# Altium schematic sheet IMX7S_CPU_INTERFACES_2.SchDoc
size A2
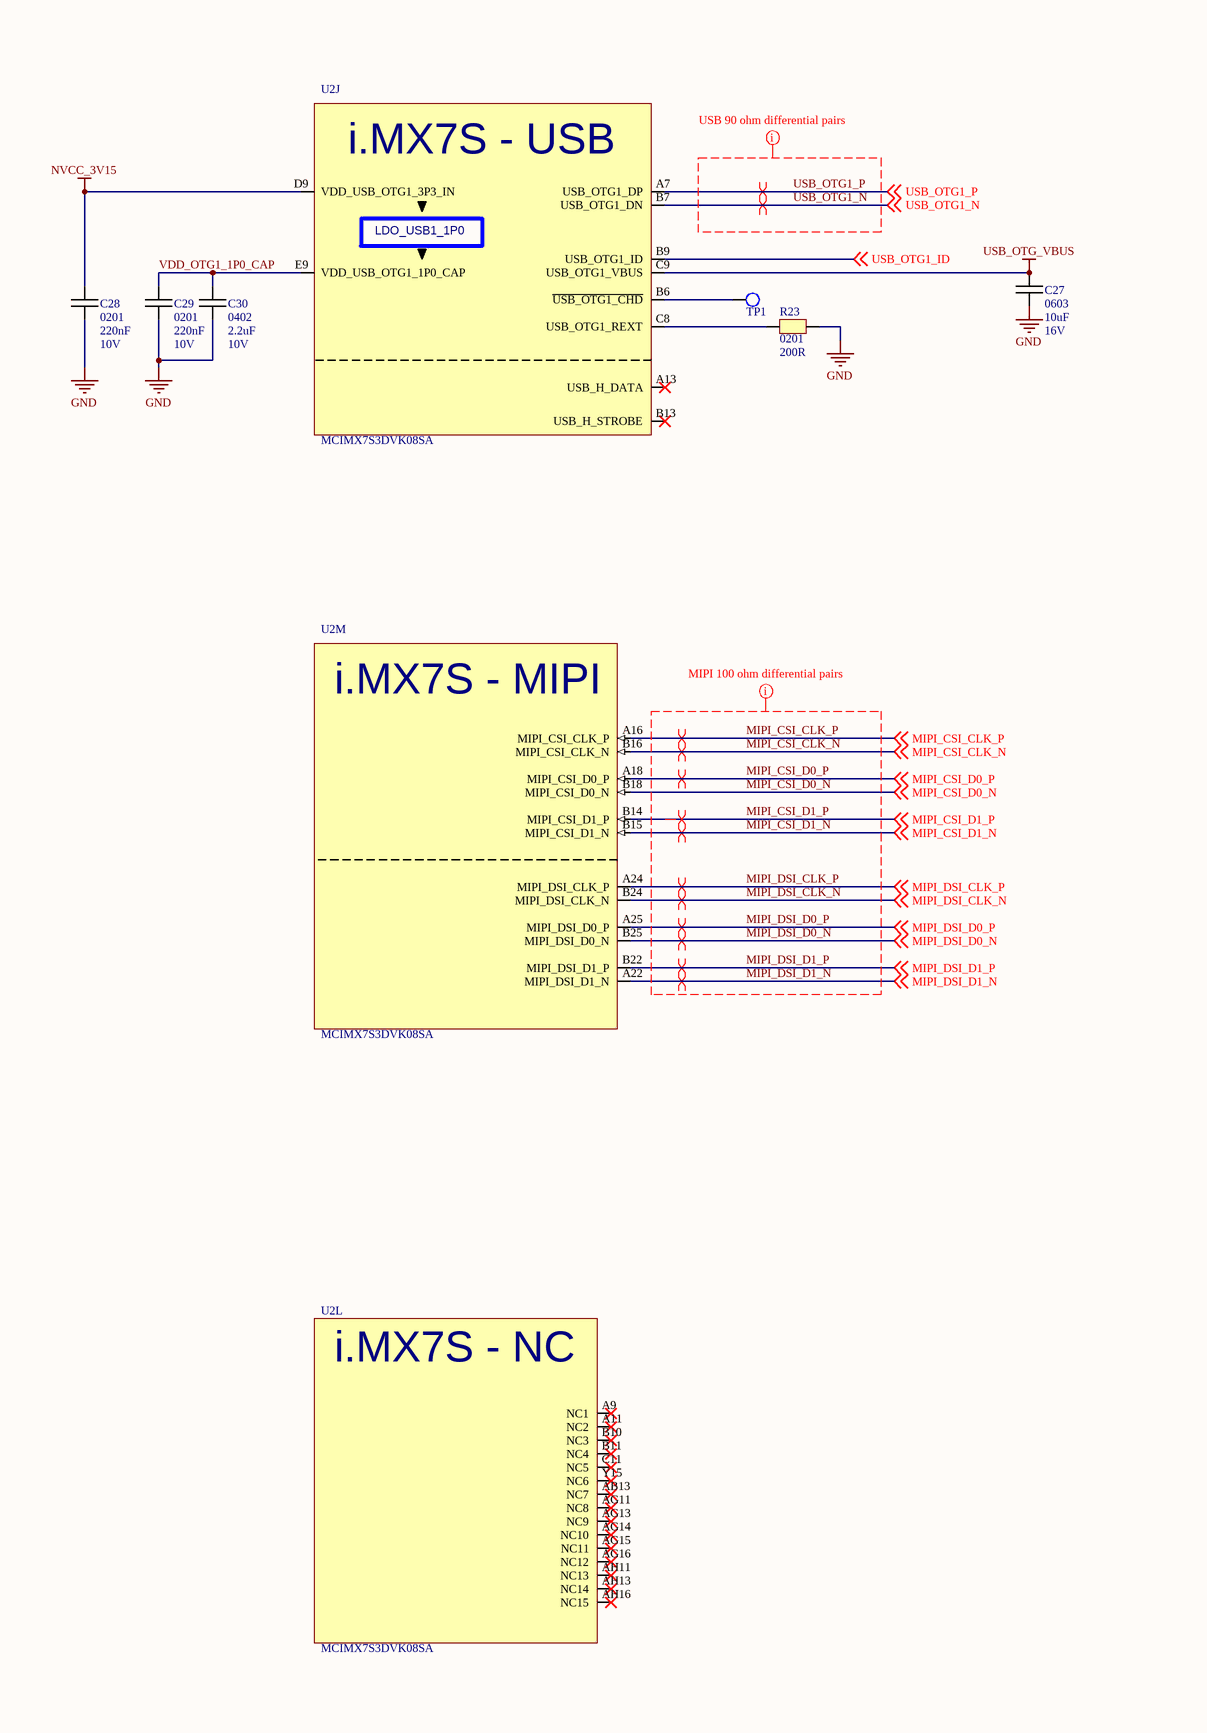
[diagram p0: IMX7S_CPU_INTERFACES_2.SchDoc, left]
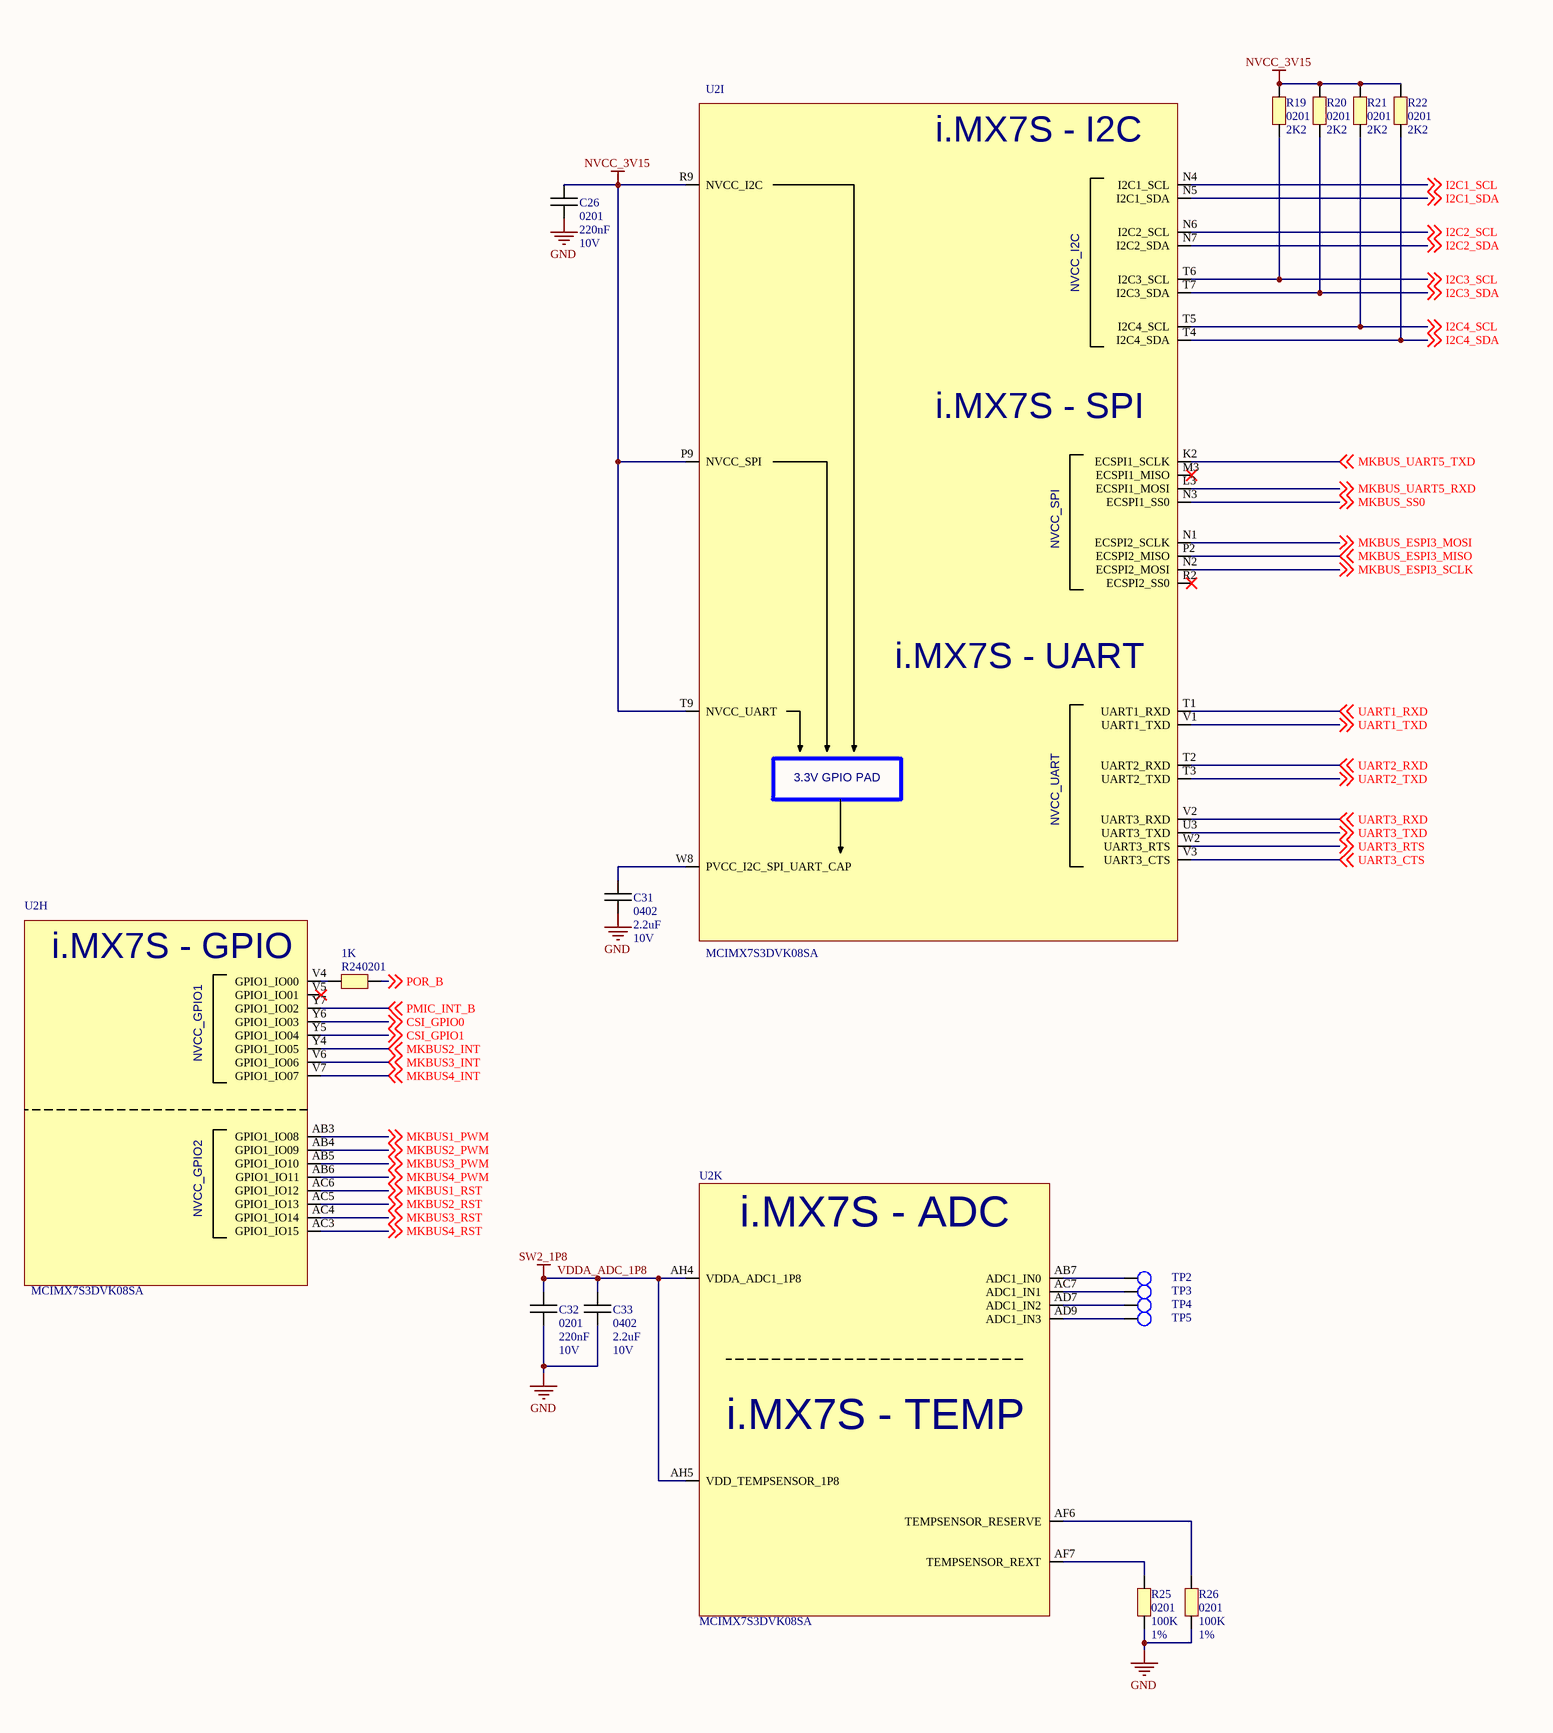
[diagram p1: IMX7S_CPU_INTERFACES_2.SchDoc, right]

## Parts
C26  value 220nF  PACKAGE: 0201  VOLTAGE: 10V  [C0201]  (hidden comment: C0201)
C27  value 10uF  PACKAGE: 0603  VOLTAGE: 16V  [C0603]  (hidden comment: C0603)
C28  value 220nF  PACKAGE: 0201  VOLTAGE: 10V  [C0201]  (hidden comment: C0201)
C29  value 220nF  PACKAGE: 0201  VOLTAGE: 10V  [C0201]  (hidden comment: C0201)
C30  value 2.2uF  PACKAGE: 0402  VOLTAGE: 10V  [C0402]  (hidden comment: C0402)
C31  value 2.2uF  PACKAGE: 0402  VOLTAGE: 10V  [C0402]  (hidden comment: C0402)
C32  value 220nF  PACKAGE: 0201  VOLTAGE: 10V  [C0201]  (hidden comment: C0201)
C33  value 2.2uF  PACKAGE: 0402  VOLTAGE: 10V  [C0402]  (hidden comment: C0402)
R19  value 2K2  PACKAGE: 0201  [R0201]  (hidden comment: R0201)
R20  value 2K2  PACKAGE: 0201  [R0201]  (hidden comment: R0201)
R21  value 2K2  PACKAGE: 0201  [R0201]  (hidden comment: R0201)
R22  value 2K2  PACKAGE: 0201  [R0201]  (hidden comment: R0201)
R23  value 200R  PACKAGE: 0201  [R0201]  (hidden comment: R0201)
R24  value 1K  PACKAGE: 0201  [R0201]  (hidden comment: R0201)
R25  value 100K  PACKAGE: 0201  VOLTAGE: 1%  [R0201]  (hidden comment: R0201)
R26  value 100K  PACKAGE: 0201  VOLTAGE: 1%  [R0201]  (hidden comment: R0201)
TP1  TestPoint  [TESTPOINT]  (value not drawn)
TP2  TestPoint  [TESTPOINT]  (value not drawn)
TP3  TestPoint  [TESTPOINT]  (value not drawn)
TP4  TestPoint  [TESTPOINT]  (value not drawn)
TP5  TestPoint  [TESTPOINT]  (value not drawn)
U2  MCIMX7S3DVK08SA  [BGA 488 PIN]  (parts H,I,J,K,L,M of 13)

## Nets
GND: C26.1 C27.1 C28.1 C29.1 C30.1 C31.1 C32.1 C33.1 R23.2 R25.1 R26.1
NVCC_3V15: C26.2 C28.2 R19.2 R20.2 R21.2 R22.2 U2.D9(VDD_USB_OTG1_3P3_IN) U2.P9(NVCC_SPI) U2.R9(NVCC_I2C) U2.T9(NVCC_UART)
USB_OTG_VBUS: C27.2 U2.C9(USB_OTG1_VBUS)
VDDA_ADC_1P8: C32.2 C33.2 U2.AH4(VDDA_ADC1_1P8) U2.AH5(VDD_TEMPSENSOR_1P8)  [also labelled SW2_1P8]
CSI_GPIO0: U2.Y6(GPIO1_IO03) ; off-sheet CSI_GPIO0
CSI_GPIO1: U2.Y5(GPIO1_IO04) ; off-sheet CSI_GPIO1
I2C1_SCL: U2.N4(I2C1_SCL) ; off-sheet I2C1_SCL
I2C1_SDA: U2.N5(I2C1_SDA) ; off-sheet I2C1_SDA
I2C2_SCL: U2.N6(I2C2_SCL) ; off-sheet I2C2_SCL
I2C2_SDA: U2.N7(I2C2_SDA) ; off-sheet I2C2_SDA
I2C3_SCL: R19.1 U2.T6(I2C3_SCL) ; off-sheet I2C3_SCL
I2C3_SDA: R20.1 U2.T7(I2C3_SDA) ; off-sheet I2C3_SDA
I2C4_SCL: R21.1 U2.T5(I2C4_SCL) ; off-sheet I2C4_SCL
I2C4_SDA: R22.1 U2.T4(I2C4_SDA) ; off-sheet I2C4_SDA
MIPI_CSI_CLK_N: U2.B16(MIPI_CSI_CLK_N) ; off-sheet MIPI_CSI_CLK_N
MIPI_CSI_CLK_P: U2.A16(MIPI_CSI_CLK_P) ; off-sheet MIPI_CSI_CLK_P
MIPI_CSI_D0_N: U2.B18(MIPI_CSI_D0_N) ; off-sheet MIPI_CSI_D0_N
MIPI_CSI_D0_P: U2.A18(MIPI_CSI_D0_P) ; off-sheet MIPI_CSI_D0_P
MIPI_CSI_D1_N: U2.B15(MIPI_CSI_D1_N) ; off-sheet MIPI_CSI_D1_N
MIPI_CSI_D1_P: U2.B14(MIPI_CSI_D1_P) ; off-sheet MIPI_CSI_D1_P
MIPI_DSI_CLK_N: U2.B24(MIPI_DSI_CLK_N) ; off-sheet MIPI_DSI_CLK_N
MIPI_DSI_CLK_P: U2.A24(MIPI_DSI_CLK_P) ; off-sheet MIPI_DSI_CLK_P
MIPI_DSI_D0_N: U2.B25(MIPI_DSI_D0_N) ; off-sheet MIPI_DSI_D0_N
MIPI_DSI_D0_P: U2.A25(MIPI_DSI_D0_P) ; off-sheet MIPI_DSI_D0_P
MIPI_DSI_D1_N: U2.A22(MIPI_DSI_D1_N) ; off-sheet MIPI_DSI_D1_N
MIPI_DSI_D1_P: U2.B22(MIPI_DSI_D1_P) ; off-sheet MIPI_DSI_D1_P
MKBUS1_PWM: U2.AB3(GPIO1_IO08) ; off-sheet MKBUS1_PWM
MKBUS1_RST: U2.AC6(GPIO1_IO12) ; off-sheet MKBUS1_RST
MKBUS2_INT: U2.Y4(GPIO1_IO05) ; off-sheet MKBUS2_INT
MKBUS2_PWM: U2.AB4(GPIO1_IO09) ; off-sheet MKBUS2_PWM
MKBUS2_RST: U2.AC5(GPIO1_IO13) ; off-sheet MKBUS2_RST
MKBUS3_INT: U2.V6(GPIO1_IO06) ; off-sheet MKBUS3_INT
MKBUS3_PWM: U2.AB5(GPIO1_IO10) ; off-sheet MKBUS3_PWM
MKBUS3_RST: U2.AC4(GPIO1_IO14) ; off-sheet MKBUS3_RST
MKBUS4_INT: U2.V7(GPIO1_IO07) ; off-sheet MKBUS4_INT
MKBUS4_PWM: U2.AB6(GPIO1_IO11) ; off-sheet MKBUS4_PWM
MKBUS4_RST: U2.AC3(GPIO1_IO15) ; off-sheet MKBUS4_RST
MKBUS_ESPI3_MISO: U2.P2(ECSPI2_MISO) ; off-sheet MKBUS_ESPI3_MISO
MKBUS_ESPI3_MOSI: U2.N1(ECSPI2_SCLK) ; off-sheet MKBUS_ESPI3_MOSI
MKBUS_ESPI3_SCLK: U2.N2(ECSPI2_MOSI) ; off-sheet MKBUS_ESPI3_SCLK
MKBUS_SS0: U2.N3(ECSPI1_SS0) ; off-sheet MKBUS_SS0
MKBUS_UART5_RXD: U2.L3(ECSPI1_MOSI) ; off-sheet MKBUS_UART5_RXD
MKBUS_UART5_TXD: U2.K2(ECSPI1_SCLK) ; off-sheet MKBUS_UART5_TXD
PMIC_INT_B: U2.Y7(GPIO1_IO02) ; off-sheet PMIC_INT_B
POR_B: R24.1 ; off-sheet POR_B
UART1_RXD: U2.T1(UART1_RXD) ; off-sheet UART1_RXD
UART1_TXD: U2.V1(UART1_TXD) ; off-sheet UART1_TXD
UART2_RXD: U2.T2(UART2_RXD) ; off-sheet UART2_RXD
UART2_TXD: U2.T3(UART2_TXD) ; off-sheet UART2_TXD
UART3_CTS: U2.V3(UART3_CTS) ; off-sheet UART3_CTS
UART3_RTS: U2.W2(UART3_RTS) ; off-sheet UART3_RTS
UART3_RXD: U2.V2(UART3_RXD) ; off-sheet UART3_RXD
UART3_TXD: U2.U3(UART3_TXD) ; off-sheet UART3_TXD
USB_OTG1_ID: U2.B9(USB_OTG1_ID) ; off-sheet USB_OTG1_ID
USB_OTG1_N: U2.B7(USB_OTG1_DN) ; off-sheet USB_OTG1_N
USB_OTG1_P: U2.A7(USB_OTG1_DP) ; off-sheet USB_OTG1_P
VDD_OTG1_1P0_CAP: C29.2 C30.2 U2.E9(VDD_USB_OTG1_1P0_CAP)
NetC31_2: C31.2 U2.W8(PVCC_I2C_SPI_UART_CAP)
NetR23_1: R23.1 U2.C8(USB_OTG1_REXT)
NetR24_2: R24.2 U2.V4(GPIO1_IO00)
NetR25_2: R25.2 U2.AF7(TEMPSENSOR_REXT)
NetR26_2: R26.2 U2.AF6(TEMPSENSOR_RESERVE)
NetTP1_1: TP1.1 U2.B6(~{USB_OTG1_CHD})
NetTP2_1: TP2.1 U2.AB7(ADC1_IN0)
NetTP3_1: TP3.1 U2.AC7(ADC1_IN1)
NetTP4_1: TP4.1 U2.AD7(ADC1_IN2)
NetTP5_1: TP5.1 U2.AD9(ADC1_IN3)

Not connected (* = marked no-connect by the designer): U2 A9(NC1)* A11(NC2)* A13(USB_H_DATA)* AB13(NC7)* AG11(NC8)* AG13(NC9)* AG14(NC10)* AG15(NC11)* AG16(NC12)* AH11(NC13)* AH13(NC14)* AH16(NC15)* B10(NC3)* B11(NC4)* B13(USB_H_STROBE)* C11(NC5)* M3(ECSPI1_MISO)* R2(ECSPI2_SS0)* V5(GPIO1_IO01)* Y15(NC6)*

## Layout directives
differential pair: MIPI_CSI_CLK_N, MIPI_CSI_CLK_P, MIPI_CSI_D0_P, MIPI_CSI_D1_N, MIPI_CSI_D1_P, MIPI_DSI_CLK_N, MIPI_DSI_CLK_P, MIPI_DSI_D0_N, MIPI_DSI_D0_P, MIPI_DSI_D1_N, MIPI_DSI_D1_P, USB_OTG1_N, USB_OTG1_P
mark named USB 90 ohm differential pairs: USB_OTG1_N, USB_OTG1_P
mark named MIPI 100 ohm differential pairs: MIPI_CSI_CLK_N, MIPI_CSI_CLK_P, MIPI_CSI_D0_N, MIPI_CSI_D0_P, MIPI_CSI_D1_N, MIPI_CSI_D1_P, MIPI_DSI_CLK_N, MIPI_DSI_CLK_P, MIPI_DSI_D0_N, MIPI_DSI_D0_P, MIPI_DSI_D1_N, MIPI_DSI_D1_P

## Notes on the sheet
- Title
- Size:
- Date:
- File:
- A2
- Number:
- Time:
- Revision:
- Sheet
- of
- (in symbol MCIMX7S3DVK08SD, part H) i.MX7S - GPIO
- (in symbol MCIMX7S3DVK08SD, part I) i.MX7S - I2C; i.MX7S - SPI; i.MX7S - UART; 3.3V GPIO PAD
- (in symbol MCIMX7S3DVK08SD, part J) i.MX7S - USB; LDO_USB1_1P0
- (in symbol MCIMX7S3DVK08SD, part K) i.MX7S - ADC; i.MX7S - TEMP
- (in symbol MCIMX7S3DVK08SD, part L) i.MX7S - NC
- (in symbol MCIMX7S3DVK08SD, part M) i.MX7S - MIPI

## Library data of the parts
C26 C28 C29 C32 = C0201: Manufacturer 1: Murata; Manufacturer Part Number 1: GRM033R61A224KE90D; Tolerance: 10%; Dielectric: X5R; Supplier 1: Farnell; Supplier Part Number 1: 2990687; Stock 1: 4290; Pricing 1: 10=0,04270, 100=0,02370, 500=0,01800, 2500=0,01350, 7500=0,00950, 15000=0,00760, 75000=0,00630 (EUR); RoHS: Yes; Mount: Surface Mount; Case/Package: 0201; Case Code (Metric): 0603; Case Code (Imperial): 0201; Min Operating Temperature: -55°C; Max Operating Temperature: 85°C; Capacitance: 220nF; Voltage Rating (DC): 10V; Packaging: Tape and Reel; Voltage Rating: 10V; Length: 0.024inch; Width: 0.012inch; Thickness: 0.013inch; ComponentLink1URL: http://www.mouser.com/ds/2/281/c02e-2905.pdf?src-supplier=Mouser; ComponentLink1Description: http://www.mouser.com/ds/2/281/c02e-2905.pdf?src-supplier=Mouser; ComponentLink2URL: http://search.murata.co.jp/Ceramy/image/img/A01X/G101/ENG/GRM033R61A224KE90-01.pdf?src-supplier=Digi-Key; ComponentLink2Description: http://search.murata.co.jp/Ceramy/image/img/A01X/G101/ENG/GRM033R61A224KE90-01.pdf?src-supplier=Digi-Key
C27 = C0603: Manufacturer 1: Murata; Manufacturer Part Number 1: GRM188R61A106KE69D; Description: Cap Ceramic 10uF 10V X5R 10% SMD 0603 85C Paper T/R; Tolerance: 10%; Dielectric: X5R; Voltage Rating: 10V; Supplier 1: Farnell; Supplier Part Number 1: 2666494; Stock 1: 472000; Pricing 1: 4000=0,02960, 20000=0,02600 (EUR); RoHS: Yes; Mount: Surface Mount; Case/Package: 0603; Case Code (Metric): 1608; Case Code (Imperial): 0603; Min Operating Temperature: -55°C; Max Operating Temperature: 85°C; Capacitance: 10uF; Packaging: Tape and Reel; Voltage Rating (DC): 10V; Length: 1.6mm; Height: 0.8mm; Width: 0.031inch; Thickness: 0.037inch; Depth: 0.8mm; REACH SVHC: No SVHC; Lead Free: Lead Free; ComponentLink1URL: http://components.arrow.com/part/dataview/0323_07281717?src-supplier=Arrow+Europe; ComponentLink1Description: http://components.arrow.com/part/dataview/0323_07281717?src-supplier=Arrow+Europe; ComponentLink2URL: http://www.farnell.com/datasheets/1955682.pdf?src-supplier=Farnell; ComponentLink2Description: http://www.farnell.com/datasheets/1955682.pdf?src-supplier=Farnell; ComponentLink3URL: http://www.mouser.com/ds/2/281/c02e-2905.pdf?src-supplier=Mouser; ComponentLink3Description: http://www.mouser.com/ds/2/281/c02e-2905.pdf?src-supplier=Mouser; ComponentLink4URL: http://search.murata.co.jp/Ceramy/image/img/A01X/G101/ENG/GRM188R61A106KE69-01.pdf?src-supplier=Digi-Key; ComponentLink4Description: http://search.murata.co.jp/Ceramy/image/img/A01X/G101/ENG/GRM188R61A106KE69-01.pdf?src-supplier=Digi-Key; ComponentLink5URL: http://www.farnell.com/datasheets/1955682.pdf?src-supplier=Newark; ComponentLink5Description: http://www.farnell.com/datasheets/1955682.pdf?src-supplier=Newark; ComponentLink6URL: http://www.farnell.com/datasheets/1955682.pdf?src-supplier=Element14; ComponentLink6Description: http://www.farnell.com/datasheets/1955682.pdf?src-supplier=Element14; ComponentLink7URL: http://psearch.en.murata.com/capacitor/product/GRM188R61A106KE69%23.pdf?src-supplier=Avnet; ComponentLink7Description: http://psearch.en.murata.com/capacitor/product/GRM188R61A106KE69%23.pdf?src-supplier=Avnet
C30 = C0402: Manufacturer 1: Murata; Manufacturer Part Number 1: GRM155R61A225KE95D; Description: Cap Ceramic 2.2uF 10V X5R 10% SMD 0402 85C Paper T/R; Material: Ceramic; Tolerance: 10%; Dielectric: X5R; Supplier 1: Farnell; Supplier Part Number 1: 2666415; Stock 1: 170000; Pricing 1: 10000=0,01960, 50000=0,01630 (EUR); RoHS: Yes; Mount: Surface Mount; Case/Package: 0402; Weight: 0.000212oz; Case Code (Metric): 1005; Case Code (Imperial): 0402; Min Operating Temperature: -55°C; Max Operating Temperature: 85°C; Capacitance: 2.2uF; Voltage Rating: 10V; Packaging: Tape and Reel; Termination: SMD/SMT; Voltage Rating (DC): 10V; Package Quantity: 10000; Length: 1mm; Height: 0.5mm; Width: 0.5mm; Thickness: 0.022inch; Depth: 0.5mm; REACH SVHC: No SVHC; Lead Free: Lead Free; ComponentLink1URL: http://www.mouser.com/ds/2/281/c02e-2905.pdf?src-supplier=Mouser; ComponentLink1Description: http://www.mouser.com/ds/2/281/c02e-2905.pdf?src-supplier=Mouser; ComponentLink2URL: http://components.arrow.com/part/dataview/0323_04264073?src-supplier=Arrow+Europe; ComponentLink2Description: http://components.arrow.com/part/dataview/0323_04264073?src-supplier=Arrow+Europe; ComponentLink3URL: http://www.farnell.com/datasheets/1872202.pdf?src-supplier=Farnell; ComponentLink3Description: http://www.farnell.com/datasheets/1872202.pdf?src-supplier=Farnell; ComponentLink4URL: http://www.farnell.com/datasheets/2047915.pdf?src-supplier=Farnell; ComponentLink4Description: http://www.farnell.com/datasheets/2047915.pdf?src-supplier=Farnell; ComponentLink5URL: http://www.farnell.com/datasheets/2047915.pdf?src-supplier=Element14; ComponentLink5Description: http://www.farnell.com/datasheets/2047915.pdf?src-supplier=Element14; ComponentLink6URL: http://psearch.en.murata.com/capacitor/product/GRM155R61A225KE95%23.pdf?src-supplier=Avnet; ComponentLink6Description: http://psearch.en.murata.com/capacitor/product/GRM155R61A225KE95%23.pdf?src-supplier=Avnet; ComponentLink7URL: https://search.murata.co.jp/Ceramy/image/img/A01X/G101/ENG/GRM155R61A225KE95-01.pdf?src-supplier=Digi-Key; ComponentLink7Description: https://search.murata.co.jp/Ceramy/image/img/A01X/G101/ENG/GRM155R61A225KE95-01.pdf?src-supplier=Digi-Key; ComponentLink8URL: http://search.murata.co.jp/Ceramy/image/img/A01X/G101/ENG/GRM155R61A225KE95-01.pdf?src-supplier=Digi-Key; ComponentLink8Description: http://search.murata.co.jp/Ceramy/image/img/A01X/G101/ENG/GRM155R61A225KE95-01.pdf?src-supplier=Digi-Key
C31 C33 = C0402: Manufacturer 1: Wurth Electronics; Manufacturer Part Number 1: 885012105013; Tolerance: 20%; Supplier 1: Farnell; Supplier Part Number 1: 2533930; Stock 1: 11802; Pricing 1: 10=0,21600, 100=0,14100, 500=0,10600, 2500=0,09320, 5000=0,07880, 10000=0,07420, 50000=0,06950 (EUR); RoHS: Yes; Mount: Surface Mount; Case/Package: 0402; Case Code (Metric): 1005; Case Code (Imperial): 0402; Min Operating Temperature: -55°C; Max Operating Temperature: 85°C; Packaging: Tape and Reel; Capacitance: 2.2uF; Voltage Rating: 10V; Length: 0.039inch; Width: 0.02inch; Thickness: 0.022inch; ComponentLink1URL: http://www.farnell.com/datasheets/2031748.pdf?src-supplier=Farnell; ComponentLink1Description: http://www.farnell.com/datasheets/2031748.pdf?src-supplier=Farnell; ComponentLink2URL: https://katalog.we-online.de/pbs/datasheet/885012105013.pdf?src-supplier=Digi-Key; ComponentLink2Description: https://katalog.we-online.de/pbs/datasheet/885012105013.pdf?src-supplier=Digi-Key
R19-R22 = R0201: Manufacturer 1: Multicomp; Manufacturer Part Number 1: MCRE000148; VOLTAGE: 0V; Description: MULTICOMP - MCRE000148 - RES, 2K2, 1%, 0.05W, 0201, THICK FILM; Resistance: 2.2kR; Power Rating: 50mW; Tolerance: 1%; Voltage Rating: 25V; Temperature Coefficient: 200ppm/°C; Supplier 1: Farnell; Supplier Part Number 1: 1711624; Stock 1: 100; Pricing 1: 10=0,01730, 100=0,01040, 500=0,00740, 2500=0,00580, 7500=0,00470 (EUR); RoHS: Yes; Case/Package: SMD/SMT; Case Code (Metric): 0603; Case Code (Imperial): 0201; Min Operating Temperature: -55°C; Max Operating Temperature: 125°C; Packaging: Tape and Reel; Composition: Thick Film; Voltage Rating (DC): 25V; Width: 0.6mm; REACH SVHC: Yes; ComponentLink1URL: https://datasheet.ciiva.com/22689/1729044-22689526.pdf?src-supplier=Element14; ComponentLink1Description: https://datasheet.ciiva.com/22689/1729044-22689526.pdf?src-supplier=Element14
R23 = R0201: Manufacturer 1: Multicomp; Manufacturer Part Number 1: MCRE000123; VOLTAGE: 0V; Description: MULTICOMP   MCRE000123   Surface Mount Chip Resistor, Thick Film, MCRE Series, 200 ohm, 50 mW,  1%, 25 V; Tolerance: 1%; Temperature Coefficient: 200ppm/°C; Voltage Rating (DC): 25V; Power Rating: 50mW; Supplier 1: Farnell; Supplier Part Number 1: 1711596; Stock 1: 825; Pricing 1: 10=0,01730, 100=0,01040, 500=0,00740, 2500=0,00580, 7500=0,00470 (EUR); RoHS: Yes; Case/Package: SMD/SMT; Case Code (Metric): 0603; Case Code (Imperial): 0201; Min Operating Temperature: -55°C; Max Operating Temperature: 125°C; Packaging: Tape and Reel; Resistance: 200R; Composition: Thick Film; Voltage Rating: 25V; Width: 0.6mm; REACH SVHC: Yes; ComponentLink1URL: https://datasheet.ciiva.com/7695/1729044-7695515.pdf?src-supplier=Element14; ComponentLink1Description: https://datasheet.ciiva.com/7695/1729044-7695515.pdf?src-supplier=Element14; ComponentLink2URL: https://datasheet.ciiva.com/22686/1729044-22686952.pdf?src-supplier=Element14; ComponentLink2Description: https://datasheet.ciiva.com/22686/1729044-22686952.pdf?src-supplier=Element14; ComponentLink3URL: https://datasheet.ciiva.com/7695/1729044-7695516.pdf?src-supplier=Element14; ComponentLink3Description: https://datasheet.ciiva.com/7695/1729044-7695516.pdf?src-supplier=Element14
R24 = R0201: Manufacturer 1: Multicomp; Manufacturer Part Number 1: MCWR02X1001FAL; VOLTAGE: 1%; Description: MULTICOMP         MCWR02X1001FAL             SMD Chip Resistor, Thick Film, 1 kohm, 25 V, 0201 [0603 Metric], 50 mW,  1%, MCWR Series; Voltage Rating: 25V; Resistance: 1kR; Power Rating: 50mW; Temperature Coefficient: 100ppm/°C; Supplier 1: Farnell; Supplier Part Number 1: 2447064; Stock 1: 75000; Pricing 1: 15000=0,00230, 75000=0,00210, 150000=0,00190 (EUR); RoHS: No; Case/Package: 0201; Case Code (Metric): 0603; Case Code (Imperial): 0201; Packaging: Cut Tape; Composition: Thick Film; Tolerance: 1%; Voltage Rating (DC): 25V; REACH SVHC: No SVHC; ComponentLink1URL: http://www.farnell.com/datasheets/1849611.pdf?src-supplier=Element14; ComponentLink1Description: http://www.farnell.com/datasheets/1849611.pdf?src-supplier=Element14
R25 R26 = R0201: Manufacturer 1: Multicomp; Manufacturer Part Number 1: MCWR02X1003FAL; Description: MULTICOMP - MCWR02X1003FAL - RES, 100K, 1%, 0.05W, THICK FILM; Resistance: 100kR; Voltage Rating: 25V; Power Rating: 50mW; Temperature Coefficient: 100ppm/°C; Supplier 1: Farnell; Supplier Part Number 1: 2447751; Stock 1: 626; Pricing 1: 10=0,01110, 100=0,00670, 500=0,00470, 2500=0,00370, 7500=0,00300 (EUR); RoHS: No; Case/Package: 0201; Case Code (Metric): 0603; Case Code (Imperial): 0201; Packaging: Cut Tape; Composition: Thick Film; Tolerance: 1%; Voltage Rating (DC): 25V; REACH SVHC: No SVHC; ComponentLink1URL: http://www.farnell.com/datasheets/2360050.pdf?src-supplier=Farnell; ComponentLink1Description: http://www.farnell.com/datasheets/2360050.pdf?src-supplier=Farnell; ComponentLink2URL: http://www.farnell.com/datasheets/1849611.pdf?src-supplier=Element14; ComponentLink2Description: http://www.farnell.com/datasheets/1849611.pdf?src-supplier=Element14
U2 = MCIMX7S3DVK08SD: Supplier 1: Mouser; Supplier Part Number 1: 771-MCIMX7S3DVK08SD